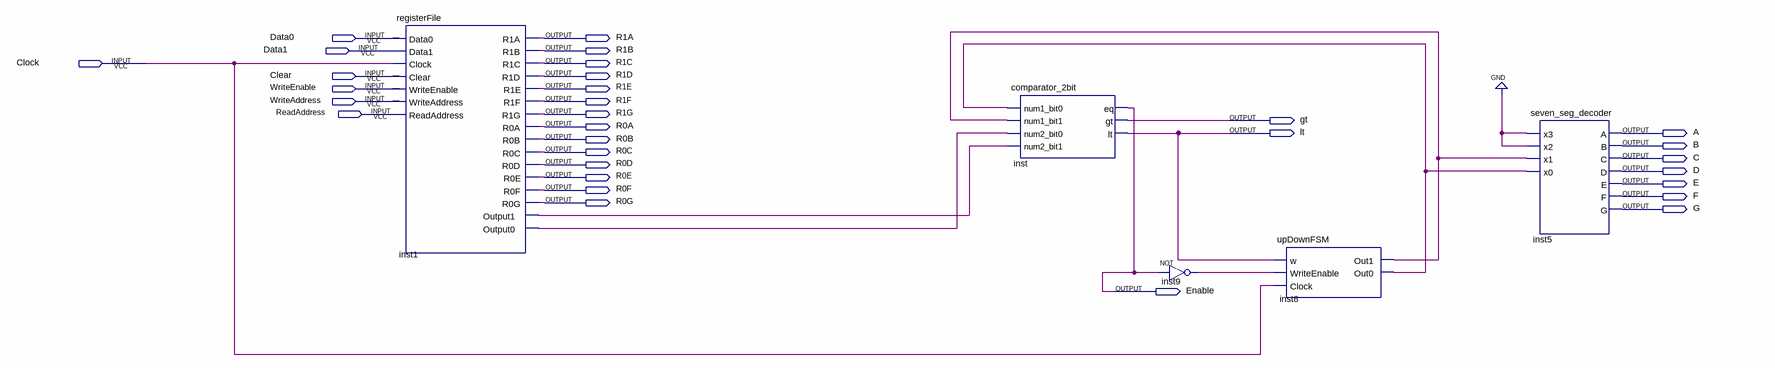
[diagram p0: schematic sheet]
// Quartus schematic comparatorTest.bdf as structural Verilog: 5 symbols, 31 pins
module comparatorTest (
  input  Data0,
  input  Data1,
  input  Clock,
  input  Clear,
  input  WriteEnable,
  input  WriteAddress,
  input  ReadAddress,
  output R1A,
  output R1B,
  output R1C,
  output R1D,
  output R1E,
  output R1F,
  output R1G,
  output gt,
  output R0A,
  output lt,
  output A,
  output R0B,
  output B,
  output R0C,
  output C,
  output R0D,
  output D,
  output R0E,
  output E,
  output R0F,
  output F,
  output R0G,
  output G,
  output Enable
);

  wire inst1_output0, inst1_output1, inst8_out0, inst8_out1, inst9_out;

  registerFile inst1 (
    .Data0(Data0), .Data1(Data1), .Clock(Clock), .Clear(Clear), .WriteEnable(WriteEnable),
    .WriteAddress(WriteAddress), .ReadAddress(ReadAddress), .R1A(R1A), .R1B(R1B), .R1C(R1C), .R1D(R1D),
    .R1E(R1E), .R1F(R1F), .R1G(R1G), .R0A(R0A), .R0B(R0B), .R0C(R0C), .R0D(R0D), .R0E(R0E), .R0F(R0F),
    .R0G(R0G), .Output1(inst1_output1), .Output0(inst1_output0));
  comparator_2bit inst (
    .num1_bit0(inst8_out0), .num1_bit1(inst8_out1), .num2_bit0(inst1_output0), .num2_bit1(inst1_output1),
    .eq(Enable), .gt(gt), .lt(lt));
  not inst9 (inst9_out, Enable);
  upDownFSM inst8 (.w(lt), .WriteEnable(inst9_out), .Clock(Clock), .Out1(inst8_out1), .Out0(inst8_out0));
  seven_seg_decoder inst5 (
    .x3(1'b0), .x2(1'b0), .x1(inst8_out1), .x0(inst8_out0), .A(A), .B(B), .C(C), .D(D), .E(E), .F(F), .G(G));
endmodule
